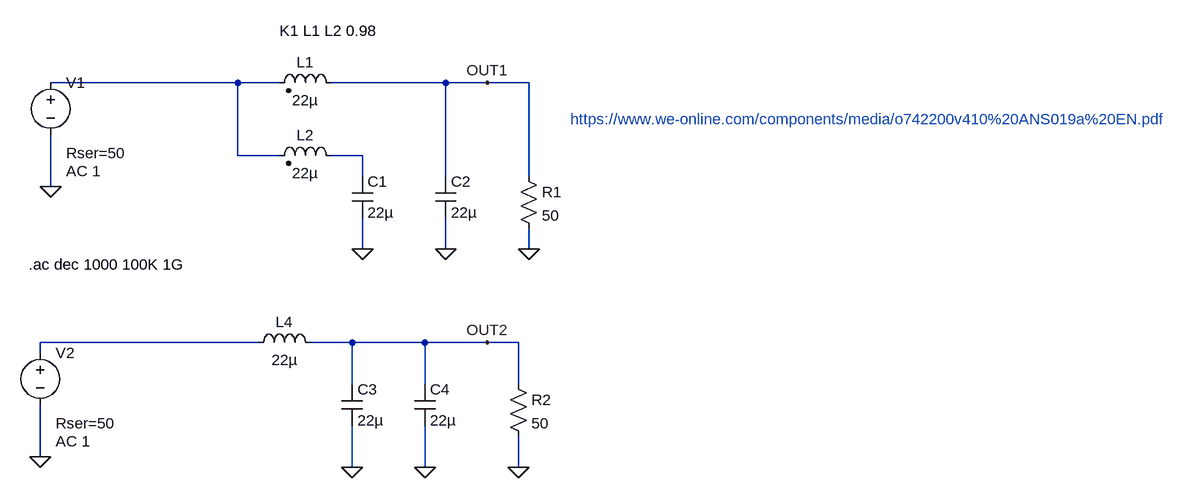
[diagram p0: schematic filter.asc]
filter.asc, the LTspice schematic file:
Version 4
SHEET 1 1636 724
WIRE 80 112 -208 112
WIRE 144 112 80 112
WIRE 400 112 224 112
WIRE 464 112 400 112
WIRE 528 112 464 112
WIRE 80 224 80 112
WIRE 144 224 80 224
WIRE 272 224 224 224
WIRE 272 256 272 224
WIRE 400 256 400 112
WIRE 528 256 528 112
WIRE -208 272 -208 192
WIRE 272 368 272 320
WIRE 400 368 400 320
WIRE 528 368 528 336
WIRE 112 512 -224 512
WIRE 256 512 192 512
WIRE 368 512 256 512
WIRE 464 512 368 512
WIRE 512 512 464 512
WIRE -224 528 -224 512
WIRE 256 576 256 512
WIRE 368 576 368 512
WIRE 512 576 512 512
WIRE -224 688 -224 608
WIRE 256 704 256 640
WIRE 368 704 368 640
WIRE 512 704 512 656
FLAG -208 272 0
FLAG 272 368 0
FLAG 400 368 0
FLAG 528 368 0
FLAG -224 688 0
FLAG 256 704 0
FLAG 368 704 0
FLAG 512 704 0
FLAG 464 112 OUT1
FLAG 464 512 OUT2
SYMBOL ind2 240 128 M270
WINDOW 0 32 56 VTop 2
WINDOW 3 5 56 VBottom 2
SYMATTR InstName L1
SYMATTR Value 22µ
SYMATTR Type ind
SYMATTR SpiceLine Rser=0.215
SYMBOL ind2 240 240 M270
WINDOW 0 32 56 VTop 2
WINDOW 3 5 56 VBottom 2
SYMATTR InstName L2
SYMATTR Value 22µ
SYMATTR Type ind
SYMATTR SpiceLine Rser=0.215
SYMBOL voltage -208 96 R0
WINDOW 123 24 152 Left 2
WINDOW 39 24 124 Left 2
SYMATTR InstName V1
SYMATTR Value ""
SYMATTR Value2 AC 1
SYMATTR SpiceLine Rser=50
SYMBOL cap 256 256 R0
SYMATTR InstName C1
SYMATTR Value 22µ
SYMATTR SpiceLine V=35 Irms=2.1 Rser=0.0099 Lser=3.27n mfg="Würth Elektronik" pn="870055673002 WCAP-PTHR 6,3 x 8" type="Al polymer"
SYMBOL cap 384 256 R0
SYMATTR InstName C2
SYMATTR Value 22µ
SYMATTR SpiceLine V=35 Irms=2.1 Rser=0.0099 Lser=3.27n mfg="Würth Elektronik" pn="870055673002 WCAP-PTHR 6,3 x 8" type="Al polymer"
SYMBOL res 512 240 R0
SYMATTR InstName R1
SYMATTR Value 50
SYMBOL voltage -224 512 R0
WINDOW 123 24 152 Left 2
WINDOW 39 24 124 Left 2
SYMATTR InstName V2
SYMATTR Value ""
SYMATTR Value2 AC 1
SYMATTR SpiceLine Rser=50
SYMBOL ind 208 528 M270
WINDOW 0 32 56 VTop 2
WINDOW 3 5 56 VBottom 2
SYMATTR InstName L4
SYMATTR Value 22µ
SYMATTR SpiceLine Rser=0.215
SYMBOL cap 240 576 R0
SYMATTR InstName C3
SYMATTR Value 22µ
SYMATTR SpiceLine V=35 Irms=2.1 Rser=0.0099 Lser=3.27n mfg="Würth Elektronik" pn="870055673002 WCAP-PTHR 6,3 x 8" type="Al polymer"
SYMBOL cap 352 576 R0
SYMATTR InstName C4
SYMATTR Value 22µ
SYMATTR SpiceLine V=35 Irms=2.1 Rser=0.0099 Lser=3.27n mfg="Würth Elektronik" pn="870055673002 WCAP-PTHR 6,3 x 8" type="Al polymer"
SYMBOL res 496 560 R0
SYMATTR InstName R2
SYMATTR Value 50
TEXT 144 32 Left 2 !K1 L1 L2 0.98
TEXT -242 392 Left 2 !.ac dec 1000 100K 1G
TEXT 592 168 Left 2 ;https://www.we-online.com/components/media/o742200v410%20ANS019a%20EN.pdf

The netlist it stands for:
* filter.asc
L1 OUT1 N001 22µ Rser=0.215
L2 N002 N001 22µ Rser=0.215
V1 N001 0 AC 1 Rser=50
C1 N002 0 22µ V=35 Irms=2.1 Rser=0.0099 Lser=3.27n mfg="Würth Elektronik" pn="870055673002 WCAP-PTHR 6,3 x 8" type="Al polymer"
C2 OUT1 0 22µ V=35 Irms=2.1 Rser=0.0099 Lser=3.27n mfg="Würth Elektronik" pn="870055673002 WCAP-PTHR 6,3 x 8" type="Al polymer"
R1 OUT1 0 50
V2 N003 0 AC 1 Rser=50
L4 OUT2 N003 22µ Rser=0.215
C3 OUT2 0 22µ V=35 Irms=2.1 Rser=0.0099 Lser=3.27n mfg="Würth Elektronik" pn="870055673002 WCAP-PTHR 6,3 x 8" type="Al polymer"
C4 OUT2 0 22µ V=35 Irms=2.1 Rser=0.0099 Lser=3.27n mfg="Würth Elektronik" pn="870055673002 WCAP-PTHR 6,3 x 8" type="Al polymer"
R2 OUT2 0 50
K1 L1 L2 0.98
.ac dec 1000 100K 1G
* https://www.we-online.com/components/media/o742200v410%20ANS019a%20EN.pdf
.backanno
.end